# EAGLE design M8341X (EAGLE 6.6.0)
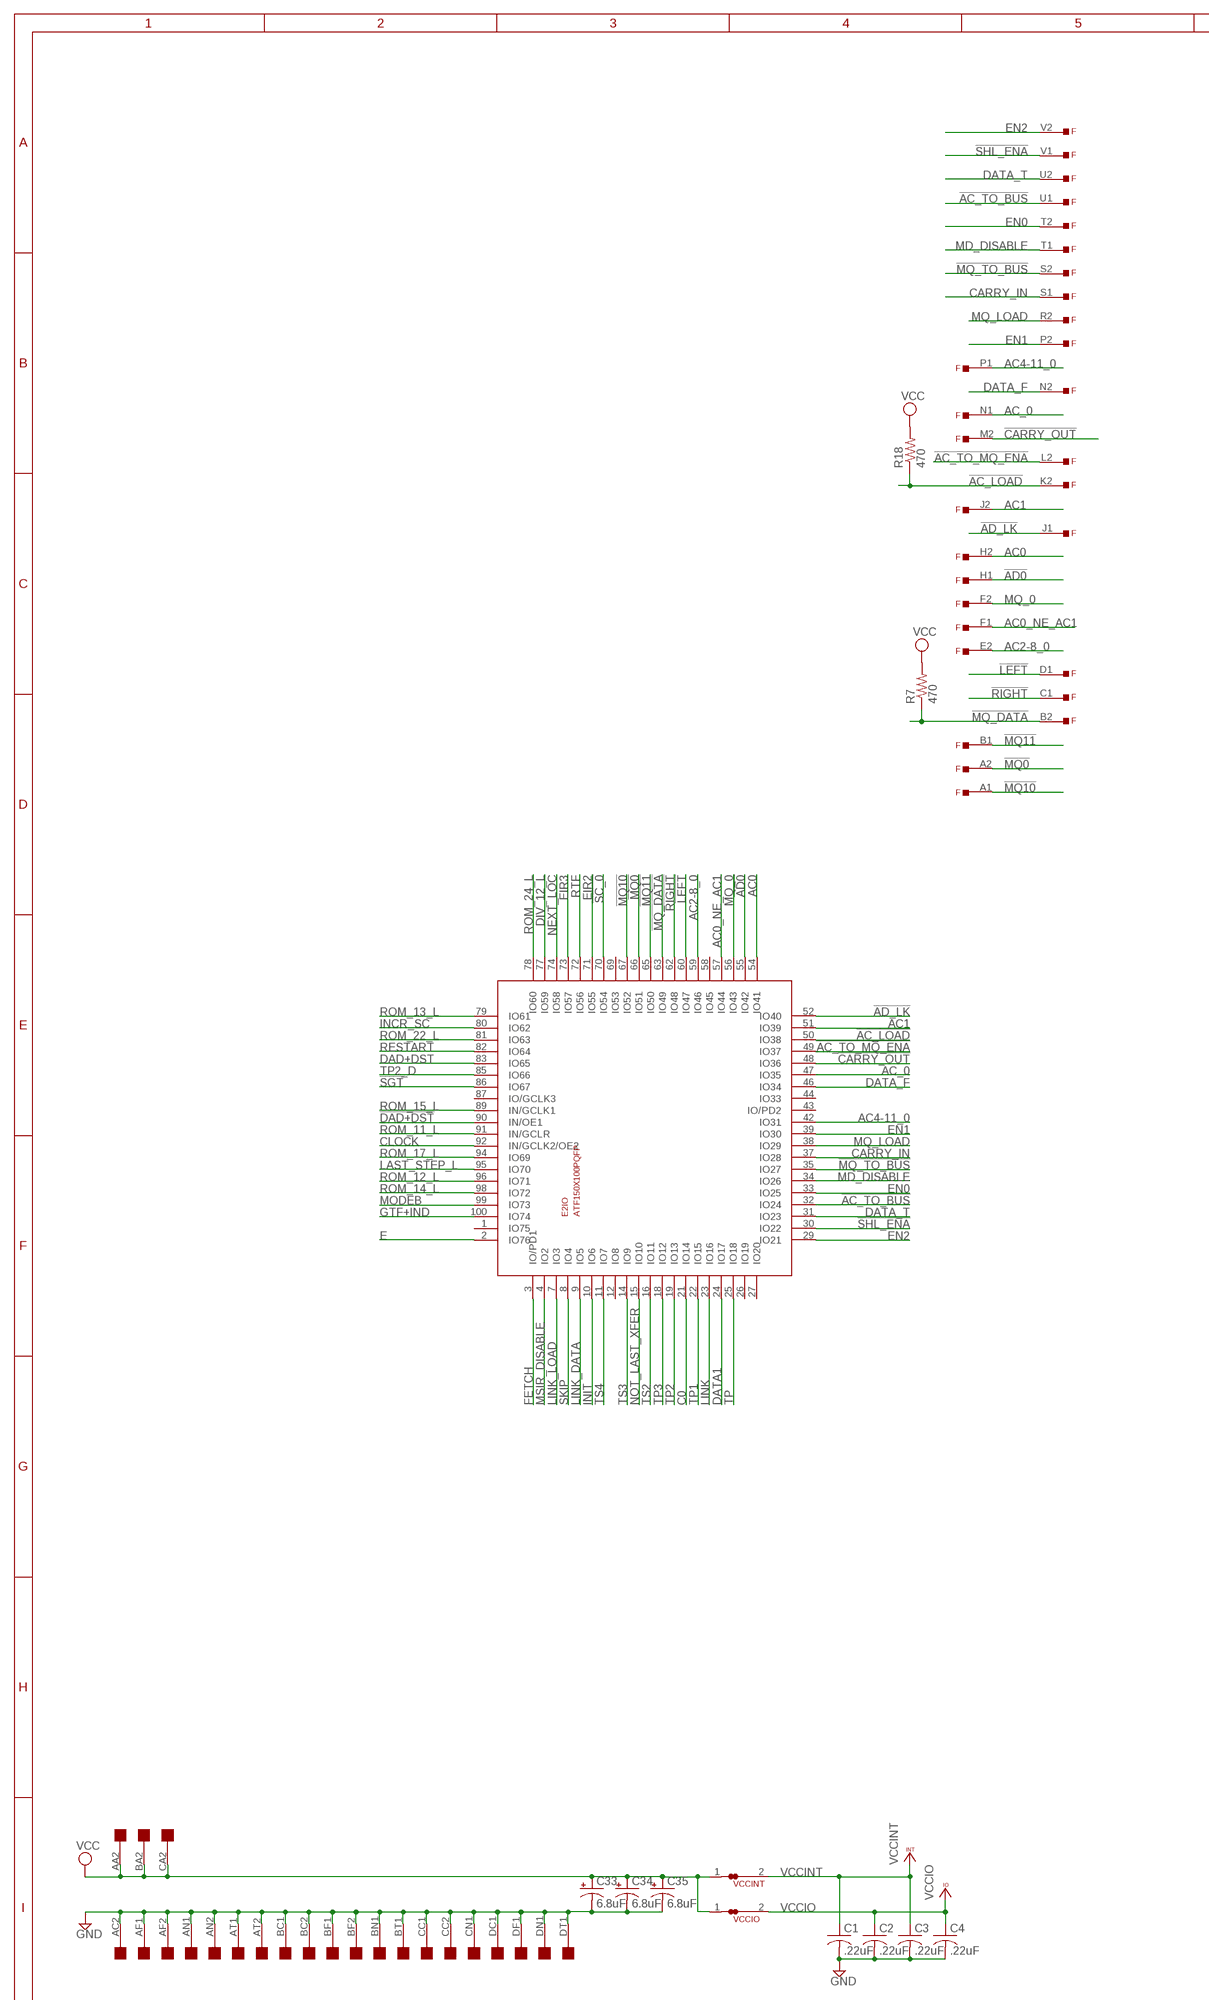
[diagram p0: schematic, sheet 1, part 1 of 2]
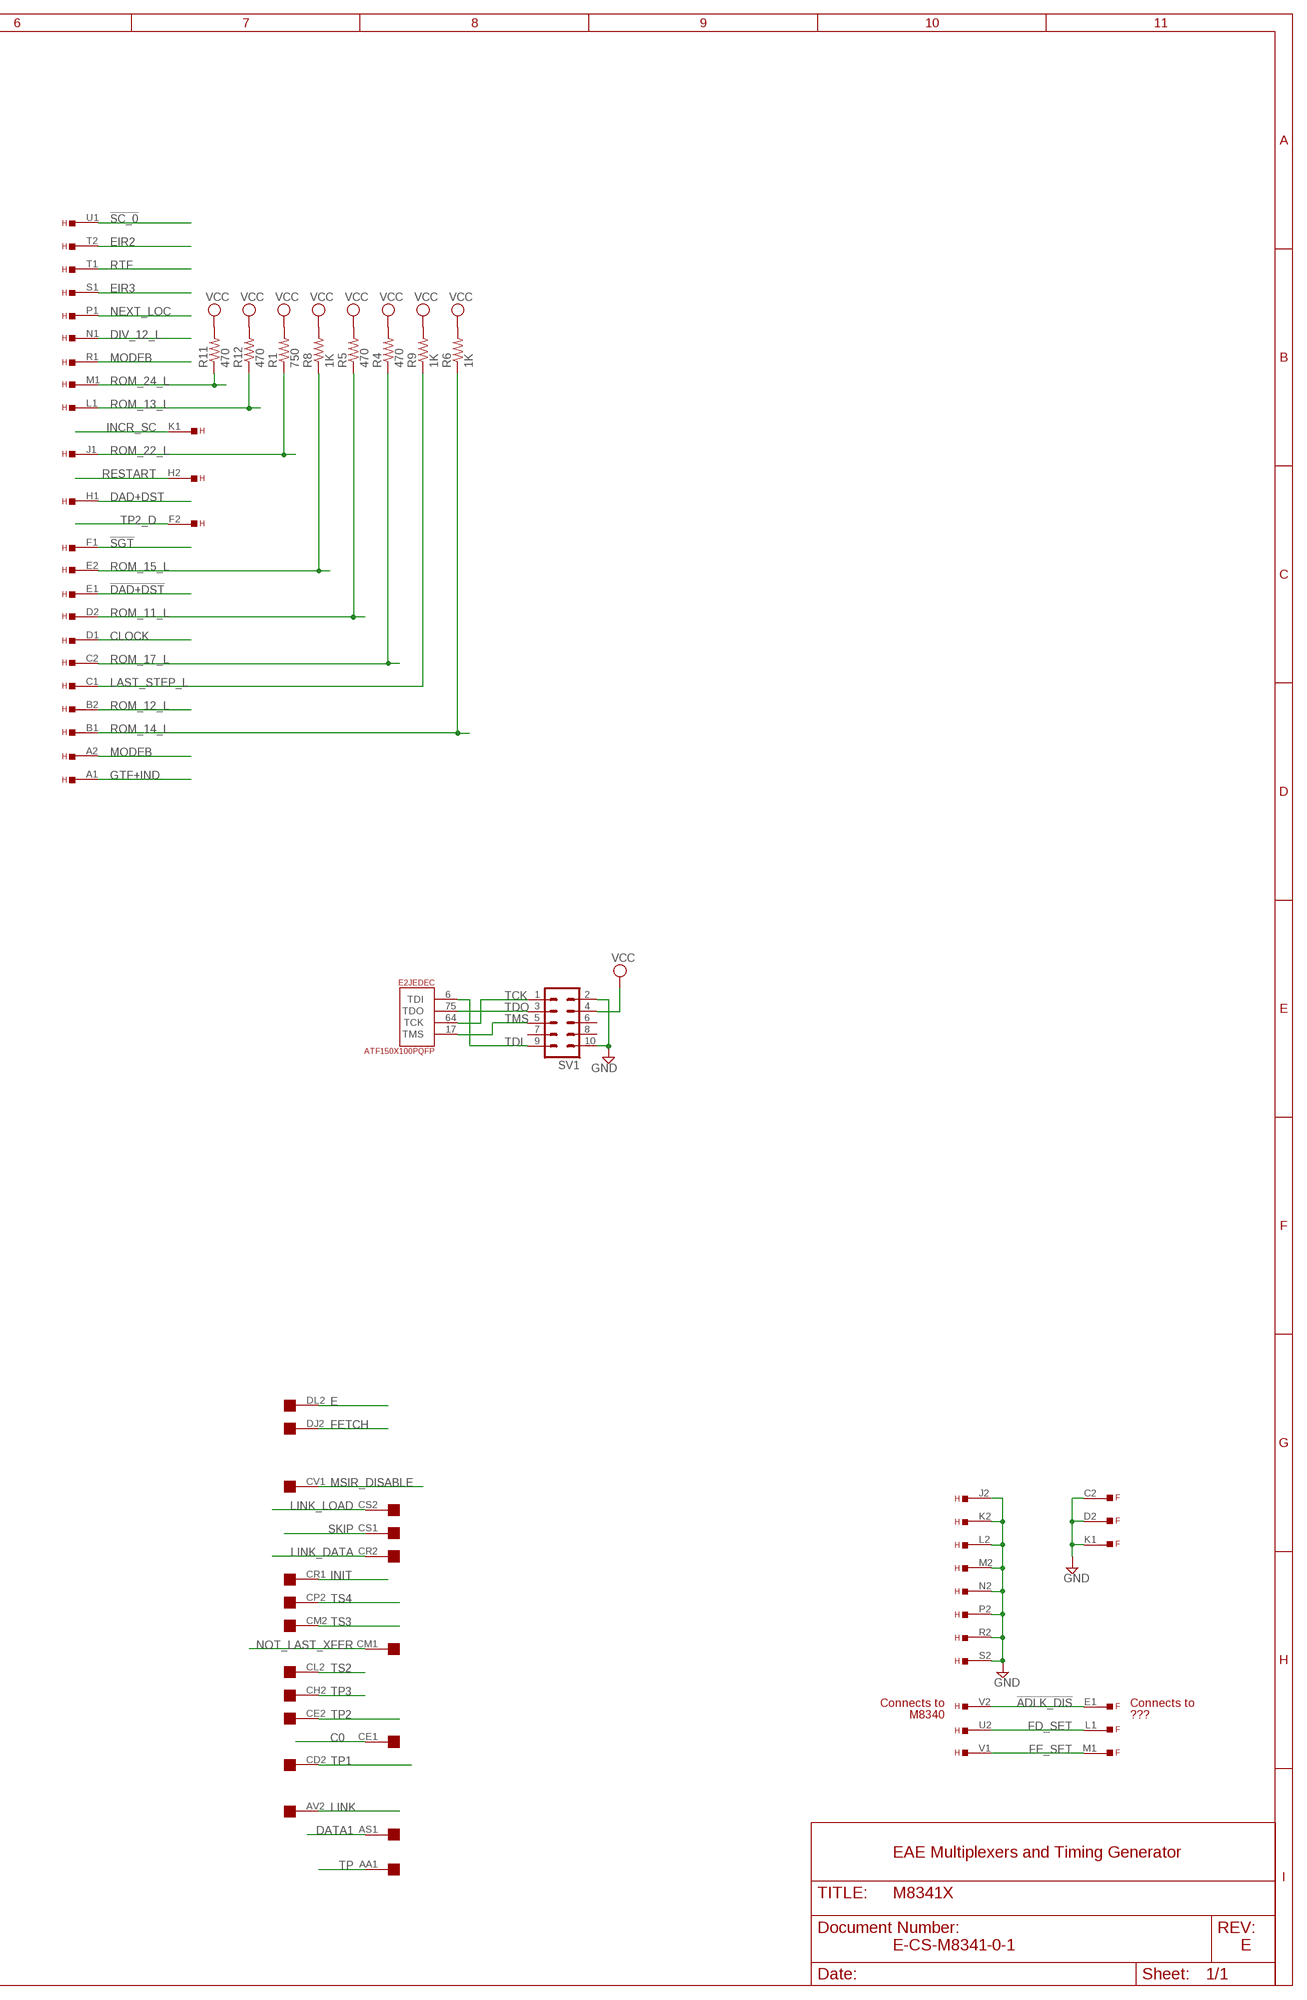
[diagram p1: schematic, sheet 1, part 2 of 2]

## Parts
C1  .22uF  C-US  [C063-025X075]
C2  .22uF  C-US  [C063-025X075]
C3  .22uF  C-US  [C063-025X075]
C4  .22uF  C-US  [C063-025X075]
C33  6.8uF  CPOL-USE20-8AXIAL  [E12-8]
C34  6.8uF  CPOL-USE20-8AXIAL  [E12-8]
C35  6.8uF  CPOL-USE20-8AXIAL  [E12-8]
E2  ATF150X100PQFP  [PQFP-100]
F  EDGE-TOP  [EDGE-CON2]
H  EDGE-TOP  [EDGE-CON2]
R1  750  R-US_0207/10  [0207/10]
R4  470  R-US_0207/10  [0207/10]
R5  470  R-US_0207/10  [0207/10]
R6  1K  R-US_0207/10  [0207/10]
R7  470  R-US_0207/10  [0207/10]
R8  1K  R-US_0207/10  [0207/10]
R9  1K  R-US_0207/10  [0207/10]
R11  470  R-US_0207/10  [0207/10]
R12  470  R-US_0207/10  [0207/10]
R18  470  R-US_0207/10  [0207/10]
SV1  ML10  [ML10]
U$2  QUAD  [EDGE-CON8]
VCCINT  JUMPER-NC1  [NC1]
VCCIO  JUMPER-NC1  [NC1]

## Nets
!AC_LOAD: E2.50(IO:IO38) F.K2 R18.1
!AC_TO_BUS: E2.32(IO:IO24) F.U1
!AC_TO_MQ_ENA: E2.49(IO:IO37) F.L2
!AD0: E2.55(IO:IO42) F.H1
!AD_LK: E2.52(IO:IO40) F.J1
!ADLK_DIS: F.E1 H.V2
!CARRY_OUT: E2.48(IO:IO36) F.M2
!DAD+DST: E2.90(IO:IN/OE1) H.E1
!LEFT: E2.60(IO:IO47) F.D1
!MQ0: E2.66(IO:IO51) F.A2
!MQ10: E2.67(IO:IO52) F.A1
!MQ11: E2.65(IO:IO50) F.B1
!MQ_DATA: E2.63(IO:IO49) F.B2 R7.1
!MQ_TO_BUS: E2.35(IO:IO27) F.S2
!RIGHT: E2.62(IO:IO48) F.C1
!SC_0: E2.70(IO:IO54) H.U1
!SGT: E2.86(IO:IO67) H.F1
!SHL_ENA: E2.30(IO:IO22) F.V1
AC0: E2.54(IO:IO41) F.H2
AC0_NE_AC1: E2.57(IO:IO44) F.F1
AC1: E2.51(IO:IO39) F.J2
AC2-8_0: E2.59(IO:IO46) F.E2
AC4-11_0: E2.42(IO:IO31) F.P1
AC_0: E2.47(IO:IO35) F.N1
C0: E2.21(IO:IO14) U$2.CE1
CARRY_IN: E2.37(IO:IO28) F.S1
CLOCK: E2.92(IO:IN/GCLK2/OE2) H.D1
DAD+DST: E2.83(IO:IO65) H.H1
DATA1: E2.24(IO:IO17) U$2.AS1
DATA_F: E2.46(IO:IO34) F.N2
DATA_T: E2.31(IO:IO23) F.U2
DIV_12_L: E2.77(IO:IO59) H.N1
E: E2.2(IO:IO76) U$2.DL2
EIR2: E2.71(IO:IO55) H.T2
EIR3: E2.73(IO:IO57) H.S1
EN0: E2.33(IO:IO25) F.T2
EN1: E2.39(IO:IO30) F.P2
EN2: E2.29(IO:IO21) F.V2
FD_SET: F.L1 H.U2
FE_SET: F.M1 H.V1
FETCH: E2.3(IO:IO/PD1) U$2.DJ2
GND [supply]: C1.2 C2.2 C3.2 C4.2 C33.- C34.- C35.- F.C2 F.D2 F.K1 H.J2 H.K2 H.L2 H.M2 H.N2 H.P2 H.R2 H.S2 SV1.2 SV1.10 U$2.AC2 U$2.AF1 U$2.AF2 U$2.AN1 U$2.AN2 U$2.AT1 U$2.AT2 U$2.BC1 U$2.BC2 U$2.BF1 U$2.BF2 U$2.BN1 U$2.BT1 U$2.CC1 U$2.CC2 U$2.CN1 U$2.DC1 U$2.DF1 U$2.DN1 U$2.DT1
GTF+IND: E2.100(IO:IO74) H.A1
INCR_SC: E2.80(IO:IO62) H.K1
INIT: E2.10(IO:IO6) U$2.CR1
LAST_STEP_L: E2.95(IO:IO70) H.C1 R9.1
LINK: E2.23(IO:IO16) U$2.AV2
LINK_DATA: E2.9(IO:IO5) U$2.CR2
LINK_LOAD: E2.7(IO:IO3) U$2.CS2
MD_DISABLE: E2.34(IO:IO26) F.T1
MODEB: E2.99(IO:IO73) H.A2 H.R1
MQ_0: E2.56(IO:IO43) F.F2
MQ_LOAD: E2.38(IO:IO29) F.R2
MSIR_DISABLE: E2.4(IO:IO2) U$2.CV1
NEXT_LOC: E2.74(IO:IO58) H.P1
NOT_LAST_XFER: E2.15(IO:IO10) U$2.CM1
RESTART: E2.82(IO:IO64) H.H2
ROM_11_L: E2.91(IO:IN/GCLR) H.D2 R5.1
ROM_12_L: E2.96(IO:IO71) H.B2
ROM_13_L: E2.79(IO:IO61) H.L1 R12.1
ROM_14_L: E2.98(IO:IO72) H.B1 R6.1
ROM_15_L: E2.89(IO:IN/GCLK1) H.E2 R8.1
ROM_17_L: E2.94(IO:IO69) H.C2 R4.1
ROM_22_L: E2.81(IO:IO63) H.J1 R1.1
ROM_24_L: E2.78(IO:IO60) H.M1 R11.1
RTF: E2.72(IO:IO56) H.T1
SKIP: E2.8(IO:IO4) U$2.CS1
TCK: E2.64(JEDEC:TCK) SV1.1
TDI: E2.6(JEDEC:TDI) SV1.9
TDO: E2.75(JEDEC:TDO) SV1.3
TMS: E2.17(JEDEC:TMS) SV1.5
TP: E2.25(IO:IO18) U$2.AA1
TP1: E2.22(IO:IO15) U$2.CD2
TP2: E2.19(IO:IO13) U$2.CE2
TP2_D: E2.85(IO:IO66) H.F2
TP3: E2.18(IO:IO12) U$2.CH2
TS2: E2.16(IO:IO11) U$2.CL2
TS3: E2.14(IO:IO9) U$2.CM2
TS4: E2.11(IO:IO7) U$2.CP2
VCC [supply]: C33.+ C34.+ C35.+ R1.2 R4.2 R5.2 R6.2 R7.2 R8.2 R9.2 R11.2 R12.2 R18.2 SV1.4 U$2.AA2 U$2.BA2 U$2.CA2 VCCINT.1 VCCIO.1
VCCINT: C1.1 C3.1 VCCINT.2
VCCIO: C2.1 C4.1 VCCIO.2
Unconnected: E2.1(IO:IO75) E2.12(IO:IO8) E2.26(IO:IO19) E2.27(IO:IO20) E2.43(IO:IO/PD2) E2.44(IO:IO33) E2.58(IO:IO45) E2.69(IO:IO53) E2.87(IO:IO/GCLK3) F.R1 SV1.6 SV1.7 SV1.8 U$2.AB1 U$2.AB2 U$2.AC1 U$2.AD1 U$2.AD2 U$2.AE1 U$2.AE2 U$2.AH1 U$2.AH2 U$2.AJ1 U$2.AJ2 U$2.AK1 U$2.AK2 U$2.AL1 U$2.AL2 U$2.AM1 U$2.AM2 U$2.AP1 U$2.AP2 U$2.AR1 U$2.AR2 U$2.AS2 U$2.AU1 U$2.AU2 U$2.AV1 U$2.BA1 U$2.BB1 U$2.BB2 U$2.BD1 U$2.BD2 U$2.BE1 U$2.BE2 U$2.BH1 U$2.BH2 U$2.BJ1 U$2.BJ2 U$2.BK1 U$2.BK2 U$2.BL1 U$2.BL2 U$2.BM1 U$2.BM2 U$2.BN2 U$2.BP1 U$2.BP2 U$2.BR1 U$2.BR2 U$2.BS1 U$2.BS2 U$2.BT2 U$2.BU1 U$2.BU2 U$2.BV1 U$2.BV2 U$2.CA1 U$2.CB1 U$2.CB2 U$2.CD1 U$2.CF1 U$2.CF2 U$2.CH1 U$2.CJ1 U$2.CJ2 U$2.CK1 U$2.CK2 U$2.CL1 U$2.CN2 U$2.CP1 U$2.CT1 U$2.CT2 U$2.CU1 U$2.CU2 U$2.CV2 U$2.DA1 U$2.DA2 U$2.DB1 U$2.DB2 U$2.DC2 U$2.DD1 U$2.DD2 U$2.DE1 U$2.DE2 U$2.DF2 U$2.DH1 U$2.DH2 U$2.DJ1 U$2.DK1 U$2.DK2 U$2.DL1 U$2.DM1 U$2.DM2 U$2.DN2 U$2.DP1 U$2.DP2 U$2.DR1 U$2.DR2 U$2.DS1 U$2.DS2 U$2.DT2 U$2.DU1 U$2.DU2 U$2.DV1 U$2.DV2

## Notes on the sheet
- Connects to | Connects to
- M8340 | ???
- EAE Multiplexers and Timing Generator
- E-CS-M8341-0-1 | E

## Power pins joined to a net without a drawn wire
GND: E2.13(GND) E2.28(GND) E2.40(GND) E2.45(GND) E2.61(GND) E2.76(GND) E2.88(GND) E2.97(GND)
VCCINT: E2.41(VCCINT) E2.93(VCCINT)
VCCIO: E2.5(VCCIO) E2.20(VCCIO) E2.36(VCCIO) E2.53(VCCIO) E2.68(VCCIO) E2.84(VCCIO)

## Library data of the parts
C1-C4 = dec-con:C-US: Capacitors with funky DEC lead spacing.
C33-C35 = dec-con:CPOL-USE20-8AXIAL: A 0.8 inch electrolytic.
E2 = atmel-cpld:ATF150X100: ATF150x in 100 pin package.
F H = dec-con:EDGE-TOP: Labeled DEC edge connector, suitable for top connector.
R1 R4-R9 R11 R12 R18 = rcl:R-US_: RESISTOR, American symbol
SV1 = con-harting-ml:ML10: HARTING; OC_FARNELL: unknown; OC_NEWARK: unknown
U$2 = dec-con:QUAD: Quad-Height DEC board
VCCINT VCCIO = dec-con:JUMPER: Normally closed SMD Jumper (Generates a DRC error.)

## Net classes
0 default: width 0.381 mm
1 supply: width 0.381 mm

## Board
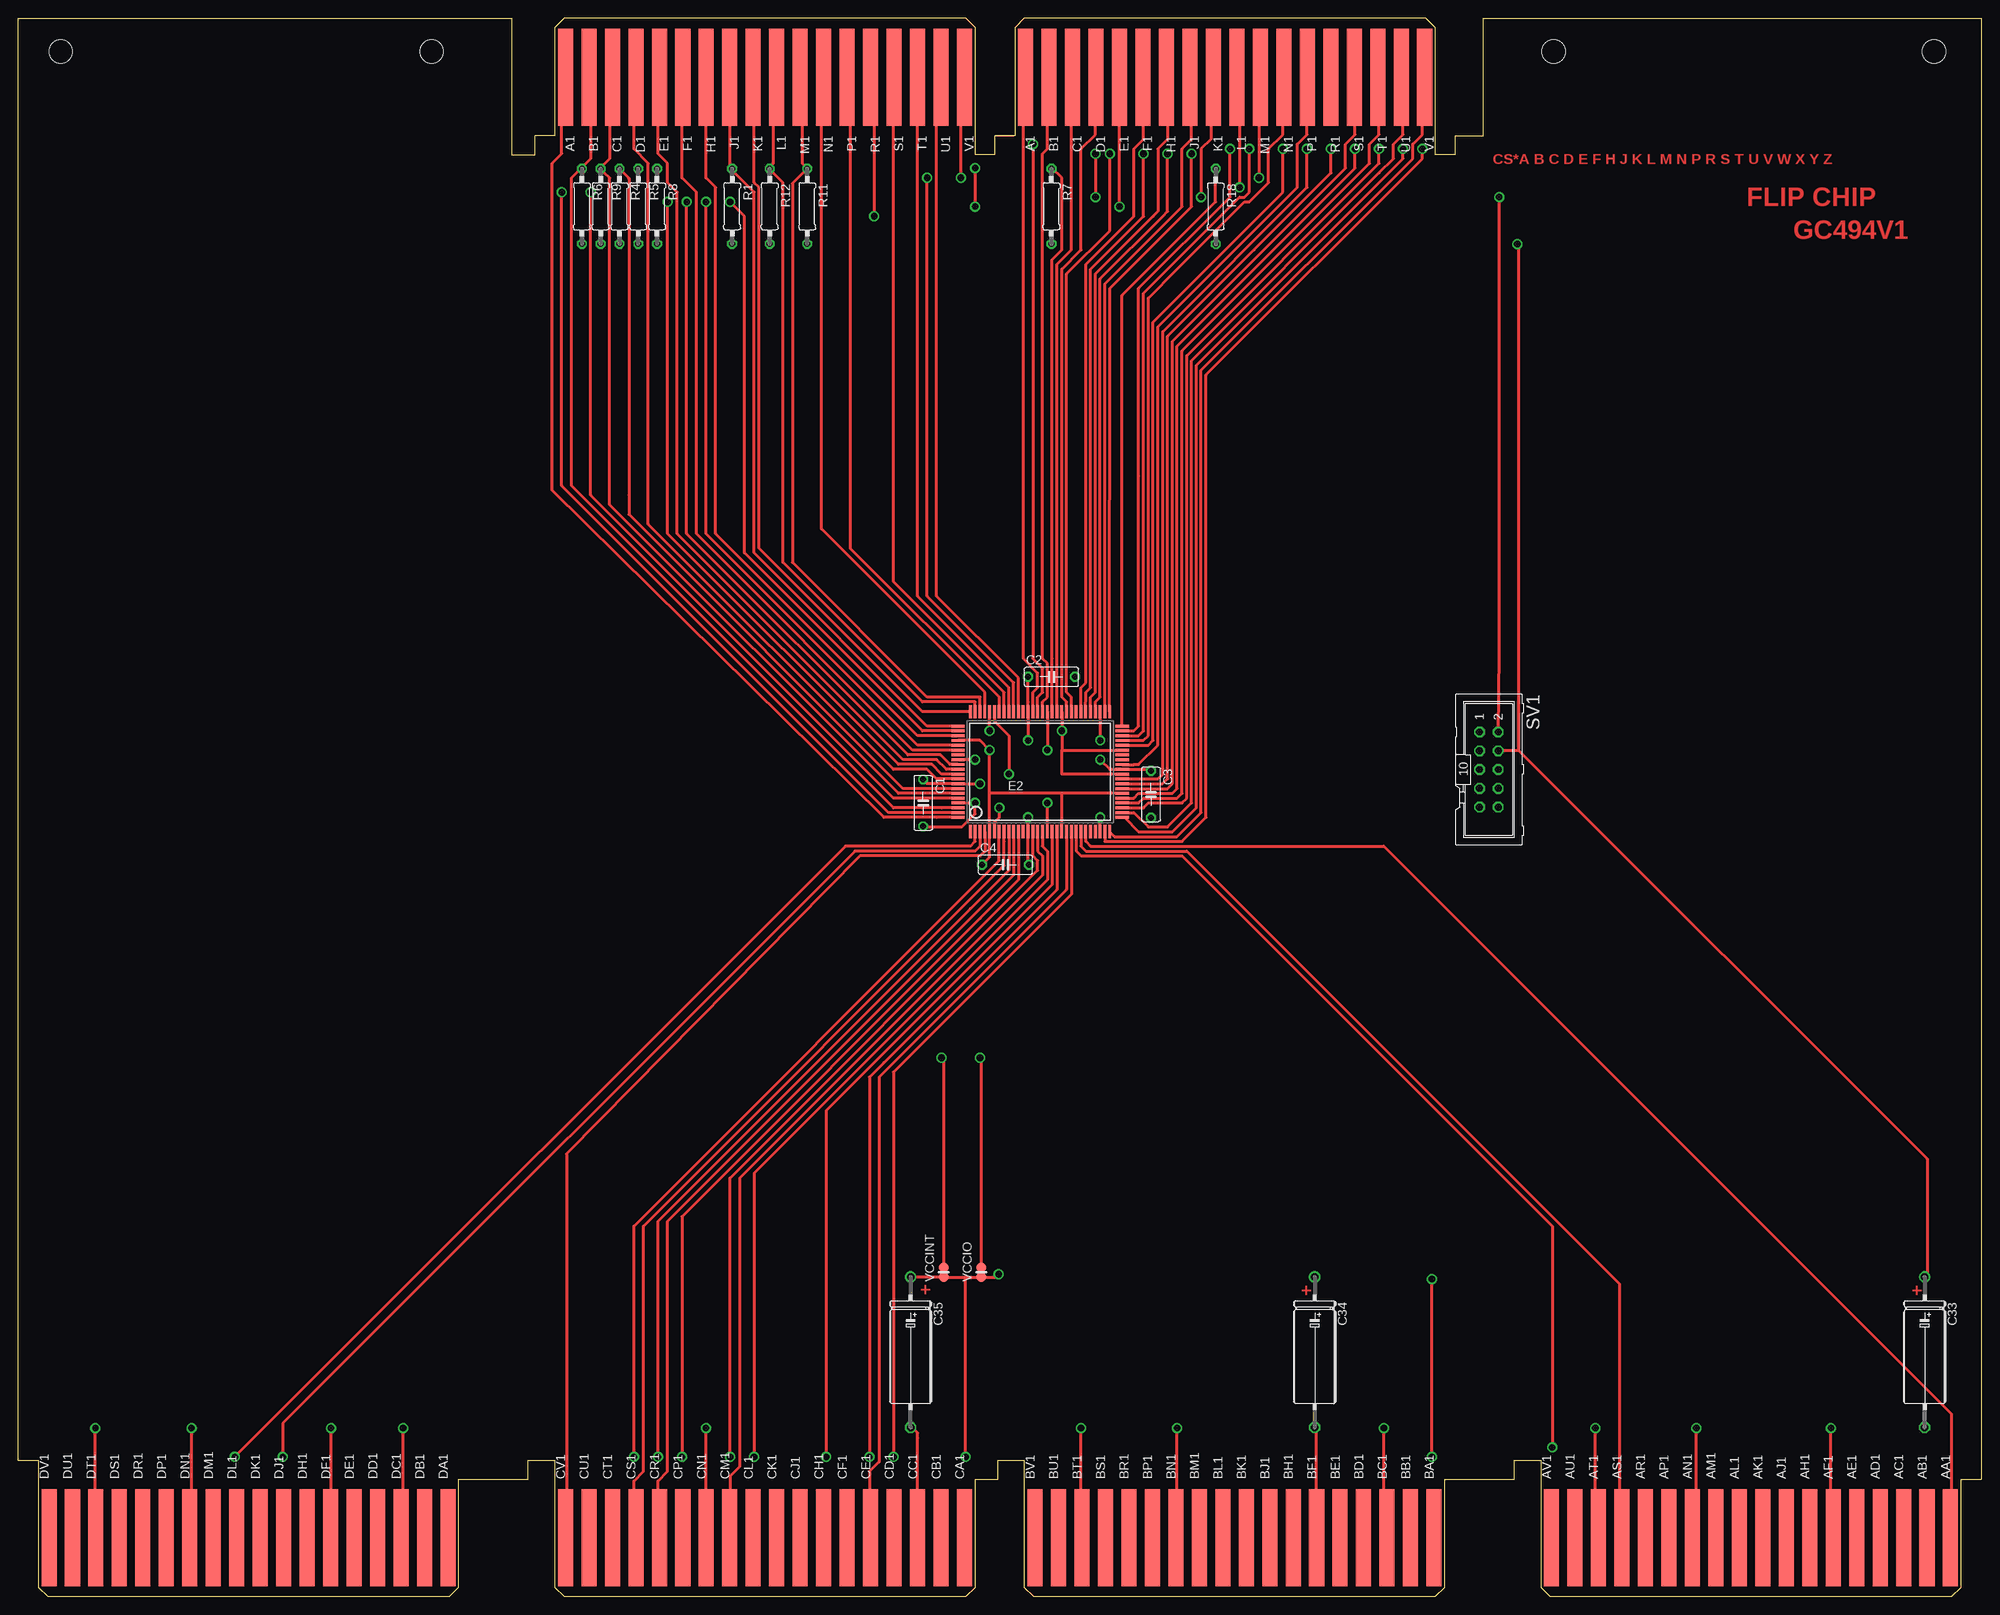
[diagram p2: board, top side]
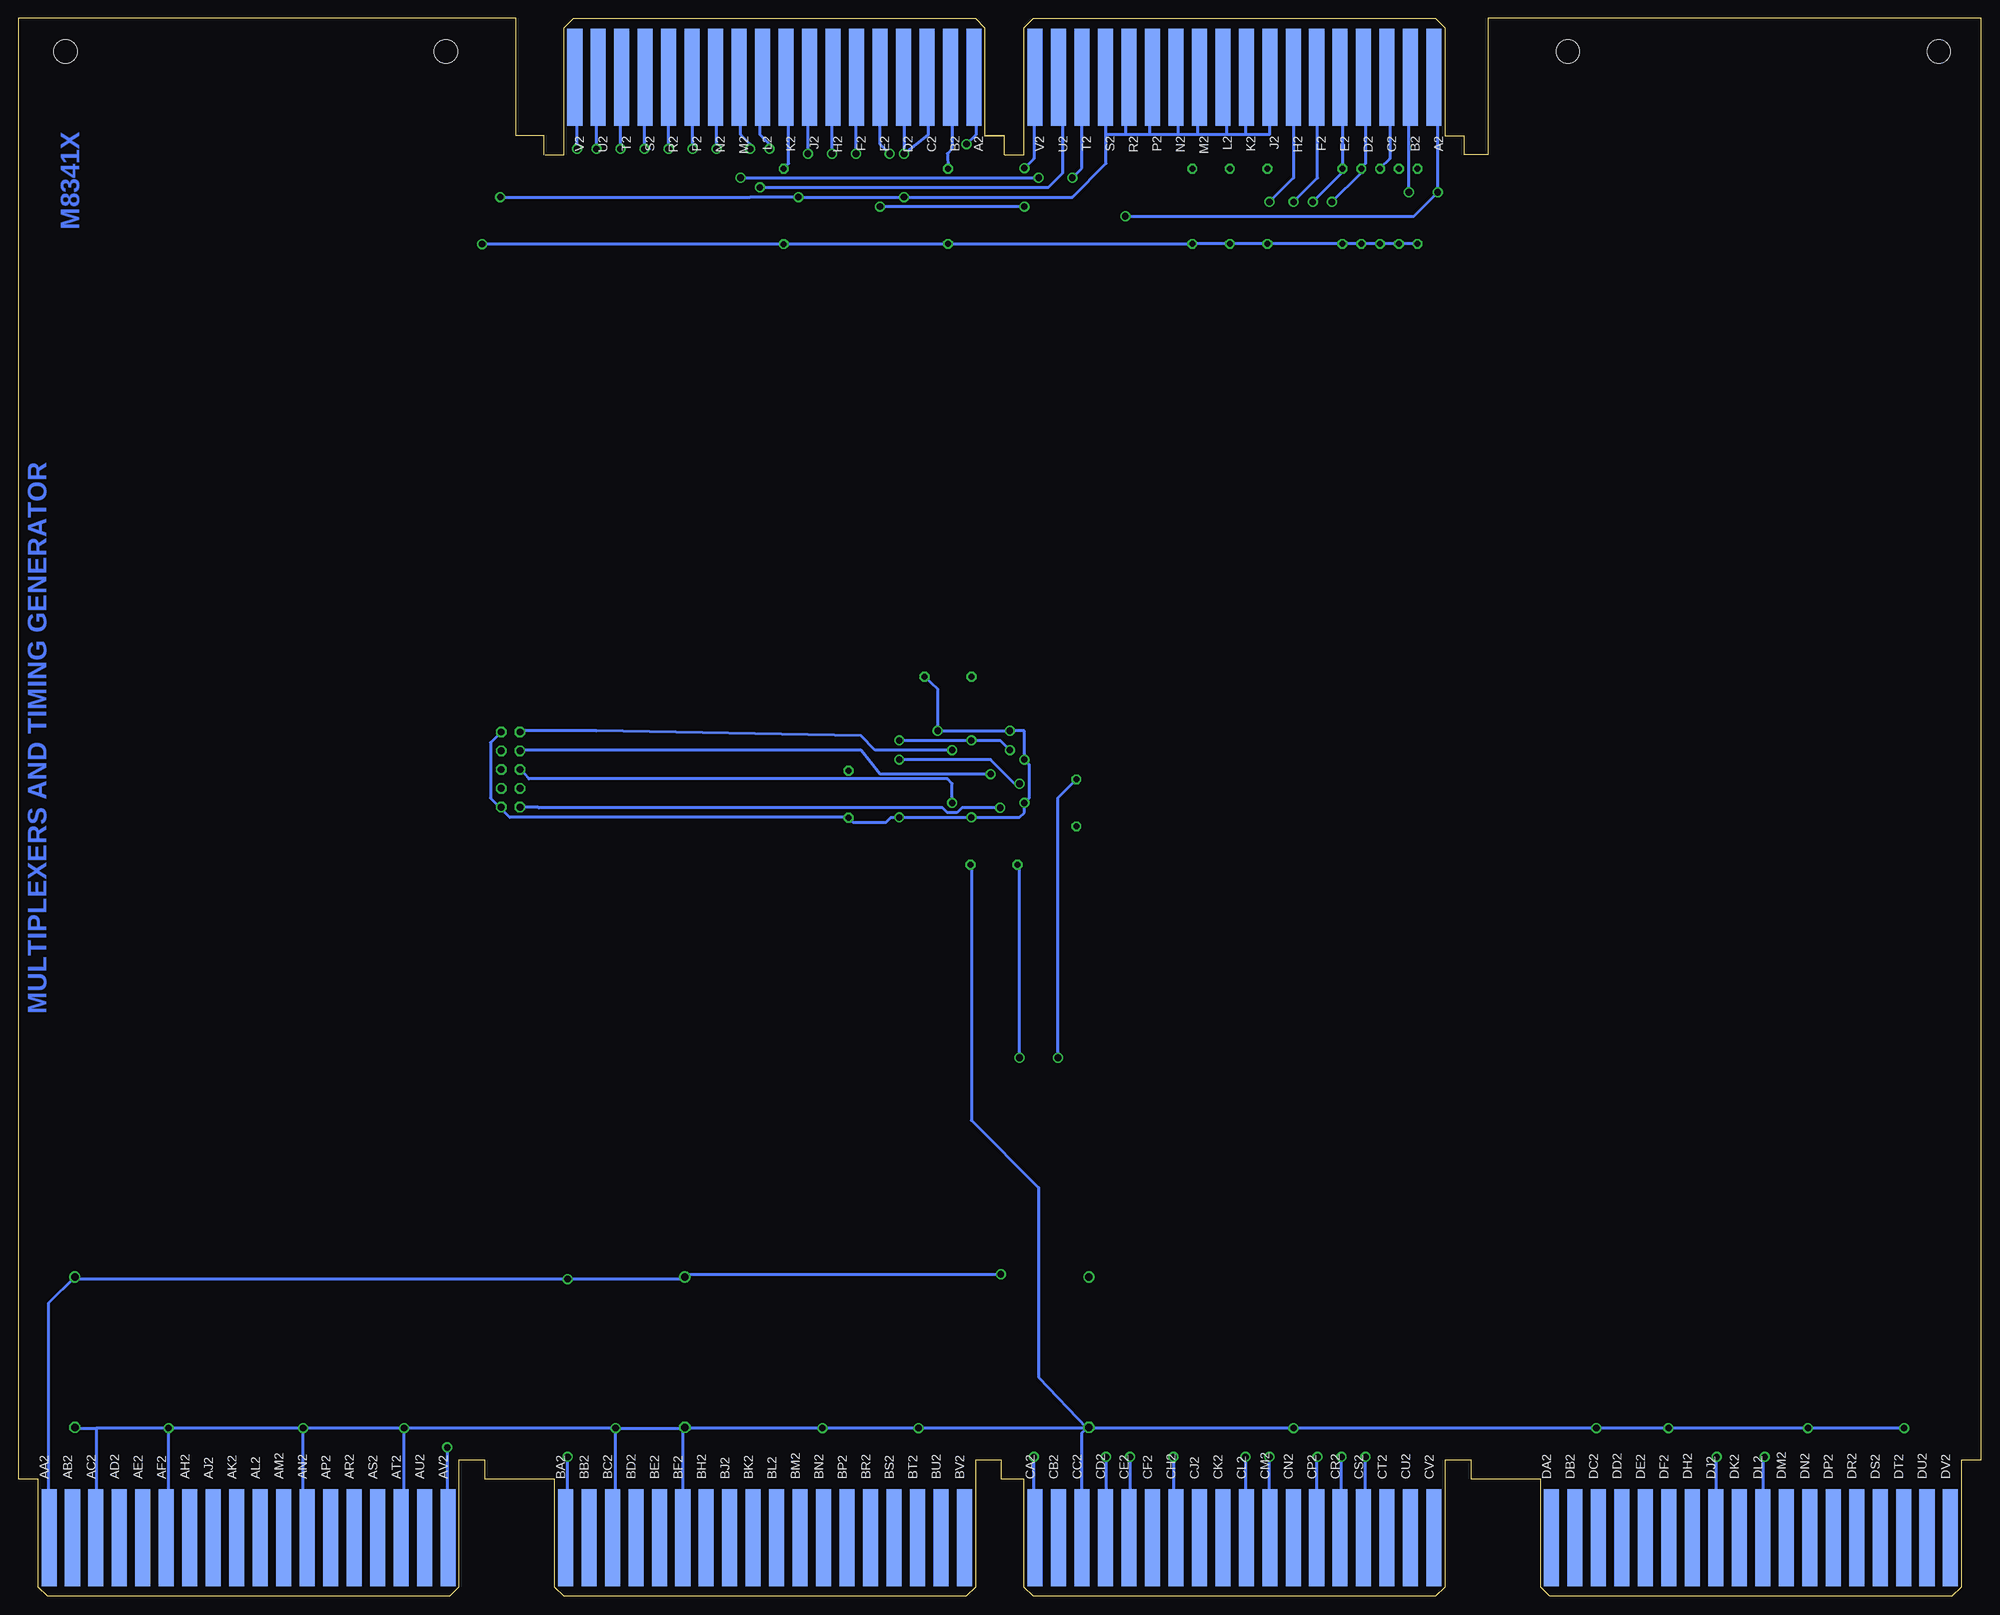
[diagram p3: board, bottom side, seen from below]

Size 265.43 x 213.36 mm. Coordinates in mm from the lower left corner, seen from the top.
Outline: 69.85,197.49 69.85,194.94 66.67,194.94 66.67,213.36 0,213.36 0,18.41 0.64,18.41
Outline: 265.43,15.88 265.43,213.36 198.12,213.36 198.12,197.49 194.31,197.49 194.31,194.94
Outline: 131.76,194.94 132.08,194.94 132.08,197.49 134.62,197.49
Copper layers (1+16): Top 0.035mm / dielectric 1.5mm / Bottom 0.035mm
Design rules "16mils *": minimum track width 15mil, minimum drill 32mil, track to track 8mil, track to pad 8mil, pad to pad 9mil, via to via 10mil, smd to smd 7mil, copper to edge 13mil, drill to drill 10mil, minimum pad ring 10mil, minimum via ring 8mil, stop-mask expansion 0mil, vias tented up to drill 0mil, thermal gap 10mil
Holes 3.2 mm at 5.71,208.91 55.88,208.91 207.65,208.91 259.08,208.91

### Footprints (pad centres in the part's own frame; a part is rotated, then mirrored left to right if it is on the bottom)
C063-025X075 = drill 0.813 octagon: 1 -2.54,0; 2 3.81,0
E12-8 = drill 1.016: + -10.16,0 | drill 1.016 octagon: - 10.16,0
PQFP-100 = smd 0.4 x 1.8: 1 -9.425,-8.1; 2 -8.775,-8.1; 3 -8.125,-8.1; 4 -7.475,-8.1; 5 -6.825,-8.1; 6 -6.175,-8.1; 7 -5.525,-8.1; 8 -4.875,-8.1; 9 -4.225,-8.1; 10 -3.575,-8.1; 11 -2.925,-8.1; 12 -2.275,-8.1; 13 -1.625,-8.1; 14 -0.975,-8.1; 15 -0.325,-8.1; 16 0.325,-8.1; 17 0.975,-8.1; 18 1.625,-8.1; 19 2.275,-8.1; 20 2.925,-8.1; 21 3.575,-8.1; 22 4.225,-8.1; 23 4.875,-8.1; 24 5.525,-8.1; 25 6.175,-8.1; 26 6.825,-8.1; 27 7.475,-8.1; 28 8.125,-8.1; 29 8.775,-8.1; 30 9.425,-8.1; 51 9.425,8.1; 52 8.775,8.1; 53 8.125,8.1; 54 7.475,8.1; 55 6.825,8.1; 56 6.175,8.1; 57 5.525,8.1; 58 4.875,8.1; 59 4.225,8.1; 60 3.575,8.1; 61 2.925,8.1; 62 2.275,8.1; 63 1.625,8.1; 64 0.975,8.1; 65 0.325,8.1; 66 -0.325,8.1; 67 -0.975,8.1; 68 -1.625,8.1; 69 -2.275,8.1; 70 -2.925,8.1; 71 -3.575,8.1; 72 -4.225,8.1; 73 -4.875,8.1; 74 -5.525,8.1; 75 -6.175,8.1; 76 -6.825,8.1; 77 -7.475,8.1; 78 -8.125,8.1; 79 -8.775,8.1; 80 -9.425,8.1 | smd 1.8 x 0.4: 31 11.1,-6.175; 32 11.1,-5.525; 33 11.1,-4.875; 34 11.1,-4.225; 35 11.1,-3.575; 36 11.1,-2.925; 37 11.1,-2.275; 38 11.1,-1.625; 39 11.1,-0.975; 40 11.1,-0.325; 41 11.1,0.325; 42 11.1,0.975; 43 11.1,1.625; 44 11.1,2.275; 45 11.1,2.925; 46 11.1,3.575; 47 11.1,4.225; 48 11.1,4.875; 49 11.1,5.525; 50 11.1,6.175; 81 -11.1,6.175; 82 -11.1,5.525; 83 -11.1,4.875; 84 -11.1,4.225; 85 -11.1,3.575; 86 -11.1,2.925; 87 -11.1,2.275; 88 -11.1,1.625; 89 -11.1,0.975; 90 -11.1,0.325; 91 -11.1,-0.325; 92 -11.1,-0.975; 93 -11.1,-1.625; 94 -11.1,-2.275; 95 -11.1,-2.925; 96 -11.1,-3.575; 97 -11.1,-4.225; 98 -11.1,-4.875; 99 -11.1,-5.525; 100 -11.1,-6.175
EDGE-CON2 = smd 13.106 x 2.032: A1 7.938,4.128; B1 7.938,7.303; C1 7.938,10.477; D1 7.938,13.652; E1 7.938,16.828; F1 7.938,20.003; H1 7.938,23.177; J1 7.938,26.352; K1 7.938,29.527; L1 7.938,32.703; M1 7.938,35.877; N1 7.938,39.053; P1 7.938,42.227; R1 7.938,45.403; S1 7.938,48.578; T1 7.938,51.752; U1 7.938,54.928; V1 7.938,58.102 | smd 13.106 x 2.032 bottom: A2 7.938,4.128; B2 7.938,7.303; C2 7.938,10.477; D2 7.938,13.652; E2 7.938,16.828; F2 7.938,20.003; H2 7.938,23.177; J2 7.938,26.352; K2 7.938,29.527; L2 7.938,32.703; M2 7.938,35.877; N2 7.938,39.053; P2 7.938,42.227; R2 7.938,45.403; S2 7.938,48.578; T2 7.938,51.752; U2 7.938,54.928; V2 7.938,58.102
0207/10 = drill 0.813 octagon: 1 -5.08,0; 2 5.08,0
ML10 = drill 0.914 octagon: 1 -5.08,-1.27; 2 -5.08,1.27; 3 -2.54,-1.27; 4 -2.54,1.27; 5 0,-1.27; 6 0,1.27; 7 2.54,-1.27; 8 2.54,1.27; 9 5.08,-1.27; 10 5.08,1.27
EDGE-CON8 = smd 2.032 x 13.106: AA1 261.303,7.938; AB1 258.127,7.938; AC1 254.952,7.938; AD1 251.778,7.938; AE1 248.602,7.938; AF1 245.428,7.938; AH1 242.252,7.938; AJ1 239.077,7.938; AK1 235.903,7.938; AL1 232.727,7.938; AM1 229.553,7.938; AN1 226.377,7.938; AP1 223.202,7.938; AR1 220.028,7.938; AS1 216.852,7.938; AT1 213.678,7.938; AU1 210.502,7.938; AV1 207.327,7.938; BA1 191.452,7.938; BB1 188.278,7.938; BC1 185.102,7.938; BD1 181.928,7.938; BE1 178.752,7.938; BF1 175.577,7.938; BH1 172.403,7.938; BJ1 169.227,7.938; BK1 166.053,7.938; BL1 162.877,7.938; BM1 159.702,7.938; BN1 156.528,7.938; BP1 153.352,7.938; BR1 150.178,7.938; BS1 147.002,7.938; BT1 143.827,7.938; BU1 140.653,7.938; BV1 137.477,7.938; CA1 127.953,7.938; CB1 124.778,7.938; CC1 121.603,7.938; CD1 118.427,7.938; CE1 115.252,7.938; CF1 112.078,7.938; CH1 108.903,7.938; CJ1 105.728,7.938; CK1 102.552,7.938; CL1 99.377,7.938; CM1 96.203,7.938; CN1 93.028,7.938; CP1 89.853,7.938; CR1 86.677,7.938; CS1 83.502,7.938; CT1 80.328,7.938; CU1 77.153,7.938; CV1 73.978,7.938; DA1 58.102,7.938; DB1 54.928,7.938; DC1 51.752,7.938; DD1 48.578,7.938; DE1 45.403,7.938; DF1 42.227,7.938; DH1 39.053,7.938; DJ1 35.877,7.938; DK1 32.703,7.938; DL1 29.527,7.938; DM1 26.352,7.938; DN1 23.177,7.938; DP1 20.003,7.938; DR1 16.828,7.938; DS1 13.652,7.938; DT1 10.477,7.938; DU1 7.303,7.938; DV1 4.128,7.938 | smd 2.032 x 13.106 bottom: AA2 261.303,7.938; AB2 258.127,7.938; AC2 254.952,7.938; AD2 251.778,7.938; AE2 248.602,7.938; AF2 245.428,7.938; AH2 242.252,7.938; AJ2 239.077,7.938; AK2 235.903,7.938; AL2 232.727,7.938; AM2 229.553,7.938; AN2 226.377,7.938; AP2 223.202,7.938; AR2 220.028,7.938; AS2 216.852,7.938; AT2 213.678,7.938; AU2 210.502,7.938; AV2 207.327,7.938; BA2 191.452,7.938; BB2 188.278,7.938; BC2 185.102,7.938; BD2 181.928,7.938; BE2 178.752,7.938; BF2 175.577,7.938; BH2 172.403,7.938; BJ2 169.227,7.938; BK2 166.053,7.938; BL2 162.877,7.938; BM2 159.702,7.938; BN2 156.528,7.938; BP2 153.352,7.938; BR2 150.178,7.938; BS2 147.002,7.938; BT2 143.827,7.938; BU2 140.653,7.938; BV2 137.477,7.938; CA2 127.953,7.938; CB2 124.778,7.938; CC2 121.603,7.938; CD2 118.427,7.938; CE2 115.252,7.938; CF2 112.078,7.938; CH2 108.903,7.938; CJ2 105.728,7.938; CK2 102.552,7.938; CL2 99.377,7.938; CM2 96.203,7.938; CN2 93.028,7.938; CP2 89.853,7.938; CR2 86.677,7.938; CS2 83.502,7.938; CT2 80.328,7.938; CU2 77.153,7.938; CV2 73.978,7.938; DA2 58.102,7.938; DB2 54.928,7.938; DC2 51.752,7.938; DD2 48.578,7.938; DE2 45.403,7.938; DF2 42.227,7.938; DH2 39.053,7.938; DJ2 35.877,7.938; DK2 32.703,7.938; DL2 29.527,7.938; DM2 26.352,7.938; DN2 23.177,7.938; DP2 20.003,7.938; DR2 16.828,7.938; DS2 13.652,7.938; DT2 10.477,7.938; DU2 7.303,7.938; DV2 4.128,7.938
NC1 = smd 1.346 x 1.346: 1 -0.635,0; 2 0.635,0

### Placement (x,y rotation side)
C1  122.37,107.93 270 top
C2  139.07,124.34 0 top
C3  153.17,109.1 270 top
C4  132.85,98.94 0 top
C33  257.81,33.02 270 top
C34  175.32,33.02 270 top
C35  120.65,33.02 270 top
E2  138.16,111.51 0 top
F  132.08,213.36 270 top
H  69.85,213.36 270 top
R1  96.52,187.96 270 top
R4  81.28,187.96 270 top
R5  83.82,187.96 270 top
R6  76.2,187.96 270 top
R7  139.7,187.96 270 top
R8  86.36,187.96 270 top
R9  78.74,187.96 270 top
R11  106.68,187.96 270 top
R12  101.6,187.96 270 top
R18  161.93,187.94 270 top
SV1  198.87,111.8 270 top
U$2  0,0 0 top
VCCINT  125.15,43.81 90 top
VCCIO  130.23,43.81 90 top

### Tracks (layer width: path | path; a pad name or v marks a point on that pad's centre or on a via)
!AC_LOAD
  Top 0.406: E2.50 149.26,175.92 161.91,188.57 161.91,193.01 R18.1
  Bottom 0.406: R18.1 161.93,193.11 161.26,193.77 161.26,205.07 F.K2
!AC_TO_BUS
  Top 0.406: E2.32 150.85,105.99 152.81,104.04 155.41,104.04 158.66,107.29 158.66,167.11 184.02,192.47 | 184.02,192.47 | 184.02,192.47 185.97,194.42 185.97,196.37 187.27,197.67 187.27,205.16 F.U1
!AC_TO_MQ_ENA  (via drill 0.9 pad 0.3)
  Top 0.406: E2.49 150.85,117.04 150.86,117.04 151.51,117.69 151.51,151.51 151.51,176.87 163.86,189.22 v163.86,195.72
  Bottom 0.406: v163.86,195.72 163.86,196.37 165.16,197.67 165.16,205.04 F.L2
!AD0
  Top 0.406: E2.55 145,121.59 145.65,122.25 145.65,178.82 153.46,186.62 154.11,187.27 154.11,195.72 155.41,197.02 155.41,204.18 F.H1
!AD_LK
  Top 0.406: E2.52 146.95,177.52 156.06,186.62 157.36,187.92 157.36,195.72 158.66,197.02 158.66,204.83 F.J1
!ADLK_DIS  (via drill 0.9 pad 0.3)
  Top 0.406: v129.4,193.12 v129.4,187.92 | v148.91,187.92 148.91,204.18 F.E1
  Bottom 0.406: H.V2 128.1,204.18 128.1,194.42 v129.4,193.12 | v129.4,187.92 v148.91,187.92
!CARRY_OUT  (via drill 0.9 pad 0.3)
  Top 0.406: E2.48 151.5,116.39 152.16,117.04 152.16,176.22 165.16,189.22 165.81,189.22 166.46,189.87 v166.46,195.72
  Bottom 0.406: v166.46,195.72 166.46,196.37 167.76,197.67 167.76,205.23 F.M2
!DAD+DST
  Top 0.381: E2.90 arc45 E2.90 125.5,111.84 124.2,113.14 119.64,113.14 89.08,143.7 89.08,189.87 87.78,191.17 87.78,193.77 86.48,195.07 86.48,199.62 86.68,199.82 H.E1
!LEFT
  Top 0.406: E2.60 141.75,120.94 141.1,121.59 141.1,179.47 143.7,182.07 143.7,195.72 145.65,197.67 145.65,204.83 F.D1
!MQ0  (via drill 0.9 pad 0.3)
  Top 0.406: v137.2,196.37 137.2,126.8 138.5,125.5 138.5,122.23 137.85,121.59 E2.66
  Bottom 0.406: F.A2 135.9,202.22 135.9,197.67 v137.2,196.37
!MQ10
  Top 0.406: E2.67 137.2,122.25 137.85,122.89 137.85,124.85 135.9,126.8 135.9,204.83 F.A1
!MQ11
  Top 0.406: E2.65 138.5,120.94 139.15,121.59 139.15,126.15 138.5,126.8 138.5,195.07 139.15,195.72 139.15,204.18 F.B1
!MQ_DATA
  Top 0.406: E2.63 139.8,126.8 139.8,180.77 141.1,182.07 141.1,191.82 139.8,193.12 R7.1
  Bottom 0.406: F.B2 139.15,203.53 139.15,195.72 139.8,195.07 R7.1
!MQ_TO_BUS  (via drill 0.9 pad 0.3)
  Top 0.406: E2.35 150.85,107.94 151.51,108.59 156.06,108.59 156.71,109.24 156.71,169.06 180.77,193.12 v180.77,195.72
  Bottom 0.406: v180.77,195.72 180.12,195.72 180.77,196.37 180.77,205.31 F.S2
!RIGHT
  Top 0.406: E2.62 140.45,128.1 140.45,180.12 142.4,182.07 142.4,204.83 F.C1
!SC_0
  Top 0.406: E2.70 135.25,119.62 135.25,124.2 124.2,135.25 124.2,204.84 H.U1
!SGT
  Top 0.406: E2.86 120.94,114.44 91.68,143.7 91.68,189.87 89.73,191.82 89.73,204.83 89.85,204.71 H.F1 | E2.86 | E2.86
!SHL_ENA
  Top 0.406: E2.30 148.25,102.74 156.71,102.74 159.96,105.99 159.96,165.81 188.57,194.42 188.57,196.37 | 188.57,196.37 | 188.57,196.37 189.87,197.67 189.87,205.11 F.V1
AC0  (via drill 0.9 pad 0.3)
  Top 0.406: E2.54 145.65,120.94 146.3,121.59 146.3,178.17 154.76,186.62 155.41,187.27 v155.41,195.07
  Bottom 0.406: v155.41,195.07 155.41,204.83 F.H2
AC0_NE_AC1
  Top 0.406: E2.57 143.7,122.89 144.35,123.55 144.35,180.12 150.86,186.62 150.86,195.72 152.16,197.02 152.16,204.83 F.F1
AC1  (via drill 0.9 pad 0.3)
  Top 0.406: E2.51 147.6,176.87 156.71,185.97 158.66,187.92 v158.66,195.07
  Bottom 0.406: v158.66,195.07 158.66,204.83 F.J2
AC2-8_0  (via drill 0.9 pad 0.3)
  Top 0.406: E2.59 142.4,121.59 141.75,122.25 141.75,178.82 147.6,184.67 v147.6,195.07
  Bottom 0.406: v147.6,195.07 148.91,196.37 F.E2
AC4-11_0
  Top 0.406: E2.42 150.85,112.49 150.86,112.49 151.51,112.49 154.11,115.09 154.11,171.66 172.96,190.52 172.96,196.37 174.26,197.67 174.26,205.38 F.P1
AC_0
  Top 0.406: E2.47 152.15,115.74 152.81,116.39 152.81,175.56 156.71,179.47 | 156.71,179.47 | 156.71,179.47 165.81,188.57 166.46,188.57 169.06,191.17 169.06,195.72 171.01,197.67 171.01,205.3 F.N1
C0
  Top 0.406: E2.21 141.74,95.57 116.39,70.23 116.39,18.21 115.09,16.91 115.09,8.1 U$2.CE1
CARRY_IN
  Top 0.406: E2.37 155.4,109.24 156.06,109.89 156.06,169.71 179.47,193.12 179.47,196.37 180.77,197.67 180.77,205.31 F.S1
CLOCK
  Top 0.381: E2.92 arc45 E2.92 124.2,110.54 122.89,111.84 118.34,111.84 85.18,145 85.18,193.77 83.23,195.72 83.23,199.62 83.5,199.9 H.D1
DAD+DST
  Top 0.406: E2.83 121.59,116.39 94.28,143.7 94.28,190.52 92.98,191.82 92.98,204.18 93.03,204.22 H.H1
DATA1
  Top 0.406: E2.24 143.69,101.45 144.35,100.79 158.01,100.79 169.71,89.08 | 169.71,89.08 | 169.71,89.08 216.53,42.27 216.53,8.26 U$2.AS1
DATA_F  (via drill 0.9 pad 0.3)
  Top 0.406: E2.46 152.8,115.09 153.46,115.74 153.46,172.31 170.36,189.22 | 170.36,189.22 | 170.36,189.22 171.01,189.87 v171.01,195.72
  Bottom 0.406: v171.01,195.72 171.01,205.3 F.N2
DATA_T  (via drill 0.9 pad 0.3)
  Top 0.406: E2.31 149.56,105.34 151.51,103.39 156.06,103.39 159.31,106.64 159.31,166.46 187.27,194.42 v187.27,195.72
  Bottom 0.406: v187.27,195.72 187.27,205.16 F.U2
DIV_12_L
  Top 0.406: E2.77 130.7,120.92 130.7,122.25 108.59,144.35 108.59,204.83 108.9,205.14 H.N1
E  (via drill 0.9 pad 0.3)
  Top 0.381: v29.26,18.86 111.84,101.44 128.75,101.44 129.4,102.09 129.39,102.1 E2.2
  Bottom 0.381: v29.26,18.86 29.53,18.59 U$2.DL2
EIR2  (via drill 0.9 pad 0.3)
  Top 0.406: E2.71 134.6,119.62 134.6,123.55 122.89,135.25 v122.89,191.82
  Bottom 0.406: v122.89,191.82 121.59,193.12 | 121.59,193.12 | 121.59,193.12 121.6,193.13 H.T2
EIR3
  Top 0.406: E2.73 133.3,120.27 133.3,122.25 118.34,137.2 118.34,200.92 118.43,201.01 H.S1
EN0  (via drill 0.9 pad 0.3)
  Top 0.406: E2.33 152.15,106.64 152.81,107.29 157.36,107.29 | 157.36,107.29 | 157.36,107.29 158.01,107.94 158.01,167.76 184.02,193.77 v184.02,195.72 | v184.02,195.72
  Bottom 0.406: v184.02,195.72 184.02,205.24 F.T2
EN1  (via drill 0.9 pad 0.3)
  Top 0.406: E2.39 154.1,110.54 154.11,110.54 | 154.11,110.54 | 154.11,110.54 154.76,111.19 154.76,171.01 174.26,190.52 v174.26,195.72
  Bottom 0.406: v174.26,195.72 174.26,205.38 F.P2
EN2  (via drill 0.9 pad 0.3)
  Top 0.406: E2.29 146.94,102.1 146.95,102.09 147.6,102.09 157.36,102.09 160.61,105.34 160.61,165.16 189.87,194.42 v189.87,195.72
  Bottom 0.406: v189.87,195.72 189.87,205.11 F.V2
FD_SET  (via drill 0.9 pad 0.3)
  Top 0.406: F.L1 165.16,204.83 v165.16,190.52
  Bottom 0.406: v165.16,190.52 126.15,190.52 124.2,192.47 124.2,204.18 H.U2
FE_SET  (via drill 0.9 pad 0.3)
  Top 0.406: F.M1 167.76,204.18 v167.76,191.82 | v127.45,191.82 127.45,204.18 H.V1
  Bottom 0.406: v167.76,191.82 v127.45,191.82
FETCH  (via drill 0.9 pad 0.3)
  Top 0.381: E2.3 130.05,101.44 129.4,100.79 113.14,100.79 35.76,23.41 v35.76,18.86
  Bottom 0.381: v35.76,18.86 35.88,18.74 U$2.DJ2
GND  (via drill 0.9 pad 0.3)
  Top 0.381: E2.97 arc-45 127.07,107.29 v129.4,107.29 129.4,105.83 127.61,104.04 122.89,104.04 arc45 C1.2 | 129.3,113.14 v129.4,113.14 E2.88 | v136.55,105.34 136.55,103.42 E2.13 136.54,99.06 C4.2 | E2.28 146.3,103.43 v146.3,105.34
  Top 0.406: v131.35,117.04 131.34,117.05 E2.76 | E2.61 141.1,119.6 v141.1,117.04 141.1,114.44 | U$2.BF2 175.56,7.95 175.56,22.76 C34.- | U$2.BC2 184.67,8.45 v184.67,22.76 | U$2.AF1 245.14,8.45 v245.14,22.76 | U$2.AT1 213.28,9.1 v213.28,22.76 | U$2.AN1 226.28,8.45 226.93,9.1 v226.93,22.76 | v10.4,22.76 10.4,8.45 U$2.DT1 10.4,7.8 | U$2.DC1 52.02,9.1 v52.02,22.76 | U$2.DN1 23.41,9.1 v23.41,22.76 | U$2.DF1 42.27,8.45 v42.27,22.76 | F.K1 161.26,202.88 161.26,197.02 159.96,195.72 v159.96,189.22 | v145.65,195.07 v145.65,189.22 | SV1.2 200.27,127.45 v200.27,189.22 | v129.4,107.29 | v129.4,107.29 | E2.40 141.11,111.19 141.1,114.44 | 141.1,114.44 148.91,114.44 E2.45 | U$2.CN1 93.03,10.36 92.98,10.4 v92.98,22.76 | U$2.CC2 121.6,21.45 121.59,22.11 120.94,22.76 C35.- | U$2.BT1 143.83,8.33 143.7,8.45 v143.7,22.76 | U$2.BN1 156.53,8.27 156.71,8.45 v156.71,22.76
  Bottom 0.381: v129.4,113.14 128.75,112.49 128.75,107.94 v129.4,107.29 129.4,105.99 130.05,105.34 v136.55,105.34 | v136.55,105.34 | v146.3,105.34 v136.55,105.34
  Bottom 0.406: 129.3,113.14 v129.4,113.14 129.4,117.04 v131.35,117.04 v141.1,117.04 141.1,122.72 C2.2 | v146.3,105.34 147.44,105.34 148.09,104.69 152.57,104.69 C3.2 153.22,105.34 198.97,105.34 200.14,106.51 SV1.10 200.35,106.72 201.57,107.94 201.57,115.45 SV1.2 | C33.- 257.5,22.76 254.89,22.76 | 254.89,22.76 254.89,13.65 U$2.AC2 | U$2.AF1 245.14,8.22 v245.14,22.76 | v245.14,22.76 254.89,22.76 | U$2.AN1 226.28,8.03 | 226.28,8.03 226.28,9.1 226.93,9.75 v226.93,22.76 | v226.93,22.76 v245.14,22.76 | U$2.BF2 175.56,7.95 175.56,9.75 175.32,10 175.56,10.4 175.56,22.76 | U$2.BC2 184.67,8.37 v184.67,22.76 | v184.67,22.76 175.56,22.76 | v184.67,22.76 v213.28,22.76 | v213.28,22.76 v226.93,22.76 | 175.56,22.76 C34.- 175.22,22.76 v156.71,22.76 v143.7,22.76 120.94,22.76 | 226.28,8.03 226.93,8.45 | U$2.AT1 213.28,9.1 v213.28,22.76 | v10.4,22.76 v23.41,22.76 v42.27,22.76 v52.02,22.76 v92.98,22.76 120.29,22.76 C35.- 120.94,22.76 | H.J2 96.24,202.88 96.24,197.67 99.49,197.67 | 99.49,197.67 102.09,197.67 | 102.09,197.67 105.99,197.67 | 105.99,197.67 108.59,197.67 | 108.59,197.67 112.49,197.67 | 112.49,197.67 115.74,197.67 | 115.74,197.67 118.34,197.67 | 118.34,197.67 118.34,204.83 H.S2 | H.K2 99.49,204.83 99.49,197.67 | H.L2 102.09,204.83 102.09,197.67 | H.M2 105.99,204.83 105.99,197.67 | H.N2 108.59,204.83 108.59,197.67 | H.P2 112.49,204.83 112.49,197.67 | H.R2 115.74,204.83 115.74,197.67 | 118.34,197.67 118.34,193.77 122.89,189.22 v145.65,189.22 v159.96,189.22 166.46,189.22 v200.27,189.22 | F.D2 145.65,204.18 v145.65,195.07 142.4,197.67 142.4,204.18 F.C2 | U$2.CC2 121.6,9.1 121.59,9.1 121.59,22.11 120.94,22.76
  Bottom 0.406: C4.2 136.55,98.84 136.55,64.37 127.45,55.27 127.45,29.66 120.94,22.76
GTF+IND
  Top 0.381: E2.100 126.14,105.34 124.2,105.34 117.04,105.34 72.18,149.56 72.18,193.77 73.48,195.07 73.48,202.22 73.98,202.72 H.A1
INCR_SC
  Top 0.406: E2.80 128.71,119.64 122.25,119.64 100.14,141.75 100.14,190.52 99.49,191.17 99.49,200.27 99.38,200.38 H.K1
INIT
  Top 0.381: E2.10 134.6,97.54 129.4,92.33 | 129.4,92.33
  Top 0.406: U$2.CR1 86.48,8.13 86.48,15.61 87.78,16.91 87.78,50.72 129.4,92.33
LAST_STEP_L
  Top 0.381: E2.95 118.99,108.59 79.98,147.6 79.98,191.82 78.6,193.04 R9.1 78.74,193.18 79.98,194.42 79.98,205.07 H.C1
LINK  (via drill 0.9 pad 0.3)
  Top 0.406: E2.23 143.04,100.8 143.7,100.14 157.36,100.14 207.43,50.07 v207.43,20.16
  Bottom 0.406: v207.43,20.16 207.43,8.04 U$2.AV2
LINK_DATA  (via drill 0.9 pad 0.3)
  Top 0.381: E2.9 133.95,98.19 129.07,93.31 128.75,92.98
  Top 0.406: v86.48,18.86 86.48,50.72 129.07,93.31
  Bottom 0.406: U$2.CR2 86.48,8.13 v86.48,18.86
LINK_LOAD  (via drill 0.9 pad 0.3)
  Top 0.381: v83.23,18.86 83.23,50.07 132.64,99.48 E2.7
  Bottom 0.381: U$2.CS2 83.23,8.21 v83.23,18.86
MD_DISABLE
  Top 0.406: E2.34 151.5,107.29 152.16,107.94 156.71,107.94 157.36,108.59 157.36,168.41 181.42,192.47 | 181.42,192.47 | 181.42,192.47 182.72,193.77 182.72,196.37 184.02,197.67 184.02,205.24 F.T1
MODEB  (via drill 0.9 pad 0.3)
  Top 0.381: E2.99 125.49,105.99 122.89,105.99 117.69,105.99 73.48,150.21 v73.48,189.87
  Top 0.406: H.R1 115.09,205.26 115.09,204.83 115.74,204.18 v115.74,186.62
  Bottom 0.381: v73.48,189.87 73.48,199.62 73.98,200.42 H.A2
  Bottom 0.406: v115.74,186.62 76.73,186.62 74.13,189.22 v73.48,189.87
MQ_0  (via drill 0.9 pad 0.3)
  Top 0.406: E2.56 144.35,122.25 145,122.89 145,179.47 152.16,186.62 v152.16,195.07
  Bottom 0.406: v152.16,195.07 152.16,204.18 F.F2
MQ_LOAD  (via drill 0.9 pad 0.3)
  Top 0.406: E2.38 154.75,109.89 155.41,110.54 155.41,170.36 167.11,182.07 | 167.11,182.07 | 167.11,182.07 177.52,192.47 v177.52,195.72
  Bottom 0.406: v177.52,195.72 177.52,205.39 F.R2
MSIR_DISABLE
  Top 0.381: E2.4 130.7,100.79 130.05,100.14 113.79,100.14 74.13,59.82 74.13,8.45 73.98,8.3 U$2.CV1
NEXT_LOC
  Top 0.406: E2.74 132.65,120.27 132.65,121.59 112.49,141.75 112.49,205.01 H.P1
NOT_LAST_XFER
  Top 0.406: E2.15 137.84,100.8 137.85,100.79 | 137.85,100.79 | 137.85,100.79 138.5,100.14 138.5,97.54 125.5,84.53 | 125.5,84.53 | 125.5,84.53 97.54,56.57 97.54,17.56 96.24,16.26 96.24,7.97 U$2.CM1
RESTART  (via drill 0.9 pad 0.3)
  Top 0.406: E2.82 122.25,117.04 98.19,141.1 98.19,186.62 v96.24,188.57
  Bottom 0.406: H.H2 92.98,205.38 92.98,191.82 v96.24,188.57
ROM_11_L  (via drill 0.9 pad 0.3)
  Top 0.381: E2.91 arc45 E2.91 124.85,111.19 123.55,112.49 118.99,112.49 87.78,143.7 87.78,184.67 v87.78,188.57
  Bottom 0.381: H.D2 83.23,205.15 83.23,193.77 83.82,193.18 R5.1 83.82,192.53 v87.78,188.57
ROM_12_L  (via drill 0.9 pad 0.3)
  Top 0.381: E2.96 118.34,107.94 77.38,148.91 v77.38,189.87
  Bottom 0.381: v77.38,189.87 77.38,199.62 77.15,199.85 H.B2
ROM_13_L
  Top 0.406: E2.79 129.4,120.94 122.25,120.94 103.39,139.8 103.39,191.17 101.6,192.96 R12.1 101.6,193.28 102.09,193.77 102.09,204.96 H.L1
ROM_14_L
  Top 0.381: E2.98 124.84,106.64 122.25,106.64 118.34,106.64 74.78,150.21 74.78,191.82 76,193.04 R6.1 76.2,193.24 77.38,194.42 77.38,205.2 H.B1
ROM_15_L  (via drill 0.9 pad 0.3)
  Top 0.381: E2.89 arc45 E2.89 125.98,112.49
  Top 0.406: 125.98,112.49 124.68,113.79 120.29,113.79 90.38,143.7 v90.38,188.57
  Bottom 0.381: H.E2 86.36,205.1 R8.1
  Bottom 0.406: v90.38,188.57 86.36,192.59 R8.1
ROM_17_L
  Top 0.381: E2.94 arc45 E2.94 119.64,109.24 82.58,146.3 82.58,148.91 | R4.1 82.51,191.81 arc-45 82.58,191.63 82.58,148.91 | 82.58,148.91 arc45 82.58,148.91
  Bottom 0.381: H.C2 79.98,205.07 79.98,194.42 81.28,193.12 R4.1
ROM_22_L
  Top 0.406: E2.81 122.89,117.69 99.49,141.1 99.49,189.87 96.52,192.84 R1.1 96.24,193.32 96.24,204.83 96.2,204.86 H.J1
ROM_24_L
  Top 0.406: E2.78 130.05,121.59 122.89,121.59 104.69,139.8 104.69,191.05 R11.1 106.68,193.08 105.99,193.77 105.99,205.16 H.M1
RTF
  Top 0.406: E2.72 133.95,120.27 133.95,122.89 121.59,135.25 121.59,202.22 121.6,202.23 H.T1
SKIP
  Top 0.381: U$2.CS1 83.23,8.21 83.23,15.61 84.53,16.91 84.53,50.07 133.3,98.84 133.3,102.09 133.29,102.75 E2.8
TCK  (via drill 0.9 pad 0.3)
  Top 0.406: E2.64 139.14,114.45 v139.15,114.44
  Bottom 0.406: v139.15,114.44 149.56,114.44 151.51,116.39 187.27,117.04 197.67,117.04 197.67,116.81 SV1.1
TDI  (via drill 0.9 pad 0.3)
  Top 0.381: E2.6 132,103.42 132,104.69 132.65,105.34 v132.65,106.64
  Bottom 0.381: v132.65,106.64 137.85,106.64 138.5,105.99 139.8,105.99 140.45,106.64 195.07,106.64 195.15,106.72 SV1.9
TDO  (via drill 0.9 pad 0.3)
  Top 0.406: E2.75 131.99,118.35 133.95,116.39 v133.95,111.19
  Bottom 0.406: v133.95,111.19 148.91,111.19 151.51,114.44 197.5,114.44 SV1.3
TMS  (via drill 0.9 pad 0.3)
  Top 0.406: E2.17 139.15,103.42 v139.15,107.29
  Bottom 0.406: v139.15,107.29 139.15,109.89 139.8,110.54 196.37,110.54 197.6,111.91 SV1.5
TP
  Top 0.406: E2.25 144.34,102.1 144.35,102.09 | 144.35,102.09 | 144.35,102.09 145,101.44 184.67,101.44 261.4,24.71 261.4,8.03 U$2.AA1
TP1  (via drill 0.9 pad 0.3)
  Top 0.406: E2.22 142.39,94.92 120.29,72.83 | 120.29,72.83 | 120.29,72.83 118.34,70.88 v118.34,18.86
  Bottom 0.406: v118.34,18.86 118.34,8.02 U$2.CD2
TP2  (via drill 0.9 pad 0.3)
  Top 0.406: E2.19 140.44,95.6 140.45,95.58 117.04,72.18 | 117.04,72.18 | 117.04,72.18 115.09,70.23 v115.09,18.86
  Bottom 0.406: v115.09,18.86 115.09,8.1 U$2.CE2
TP2_D  (via drill 0.9 pad 0.3)
  Top 0.406: E2.85 121.59,115.09 92.98,143.7 v92.98,188.57
  Bottom 0.406: v92.98,188.57 89.73,191.82 89.73,204.83 89.85,204.94 H.F2
TP3  (via drill 0.9 pad 0.3)
  Top 0.406: E2.18 139.8,103.39 139.8,96.24 | 139.8,96.24 139.79,96.25 139.8,96.24 | 139.8,96.24 | 139.8,96.24 109.24,65.67 v109.24,18.86
  Bottom 0.406: v109.24,18.86 109.24,8.28 U$2.CH2
TS2  (via drill 0.9 pad 0.3)
  Top 0.406: E2.16 138.49,101.45 139.15,100.79 139.15,96.89 137.2,94.94 | 137.2,94.94 | 137.2,94.94 99.49,57.22 v99.49,18.86
  Bottom 0.406: v99.49,18.86 99.49,8.05 U$2.CL2
TS3  (via drill 0.9 pad 0.3)
  Top 0.406: v96.24,18.86 96.24,56.57 137.85,98.19 137.85,99.49 137.2,100.14 E2.14
  Bottom 0.406: U$2.CM2 96.2,9.72 96.24,9.75 v96.24,18.86
TS4  (via drill 0.9 pad 0.3)
  Top 0.381: E2.11 135.25,96.89 130.05,91.68
  Top 0.406: 130.05,91.68 89.73,51.37 v89.73,18.86
  Bottom 0.406: v89.73,18.86 89.85,18.74 U$2.CP2
VCC  (via drill 0.9 pad 0.3)
  Top 0.406: 128.1,43.18 VCCINT.1 C35.+ | 128.1,43.18 VCCIO.1 132.18,43.18 v132.57,43.57 | v191.17,18.86 v191.17,42.92 | SV1.4 200.27,114.44 202.88,114.44 | 202.88,114.44 258.14,59.17 258.14,43.52 C33.+ | v202.73,182.87 202.88,182.72 202.88,114.44 | v128.1,18.86 128.1,43.18
  Bottom 0.406: R6.2 R9.2 R4.2 R5.2 R8.2 R1.2 R12.2 R11.2 R7.2 161.91,182.88 R18.2 v202.73,182.87 | U$2.AA2 261.4,6.5 261.4,39.66 C33.+ 257.5,42.92 v191.17,42.92 175.56,42.92 C34.+ 175.3,43.18 174.91,43.57 v132.57,43.57 | U$2.BA2 191.45,8.82 191.17,9.1 v191.17,18.86 | U$2.CA2 127.95,8.31 128.1,8.45 v128.1,18.86
VCCINT  (via drill 0.9 pad 0.3)
  Top 0.381: E2.93 arc45 E2.93 122.89,109.89 122.84,109.94 arc-45 C1.1
  Top 0.406: C3.1 153.01,111.64 152.81,111.84 E2.41 147.6,111.84 v146.3,113.14 | E2.93 v130.04,109.89 v130.05,109.89 | VCCINT.2 125.15,72.52 v124.85,72.83
  Bottom 0.406: v130.05,109.89 130.7,109.89 133.95,113.14 v146.3,113.14 | v124.85,72.83 124.85,107.99 C1.1
VCCIO  (via drill 0.9 pad 0.3)
  Top 0.381: C4.1 131.34,99.96 E2.5 131.35,103.42 131.35,108.59 | 131.35,108.59 v131.35,114.44 130.04,115.74 E2.84 | E2.20 141.1,103.42 141.1,108.59 | 141.1,108.59 131.35,108.59 | E2.36 141.1,108.59
  Top 0.406: v136.55,115.74 E2.68 136.55,119.62 136.55,120.94 136.53,121.13 C2.1 | E2.53 146.3,119.59 v146.3,115.74 | VCCIO.2 130.23,72.64 v130.05,72.83
  Bottom 0.406: v131.35,114.44 132.65,115.74 v136.55,115.74 v146.3,115.74 | v130.05,72.83 130.05,98.67 C4.1

### Text on the board
Top: CS*A B C D E F H J K L M N P R S T U V W X Y Z | FLIP CHIP | GC494V1 | + | + | +
Bottom: M8341X | MULTIPLEXERS AND TIMING GENERATOR